# Altium schematic sheet [08] - OUTPUT.SchDoc
size A3; DocumentNumber: 8; SheetNumber: 8; SheetTotal: 10
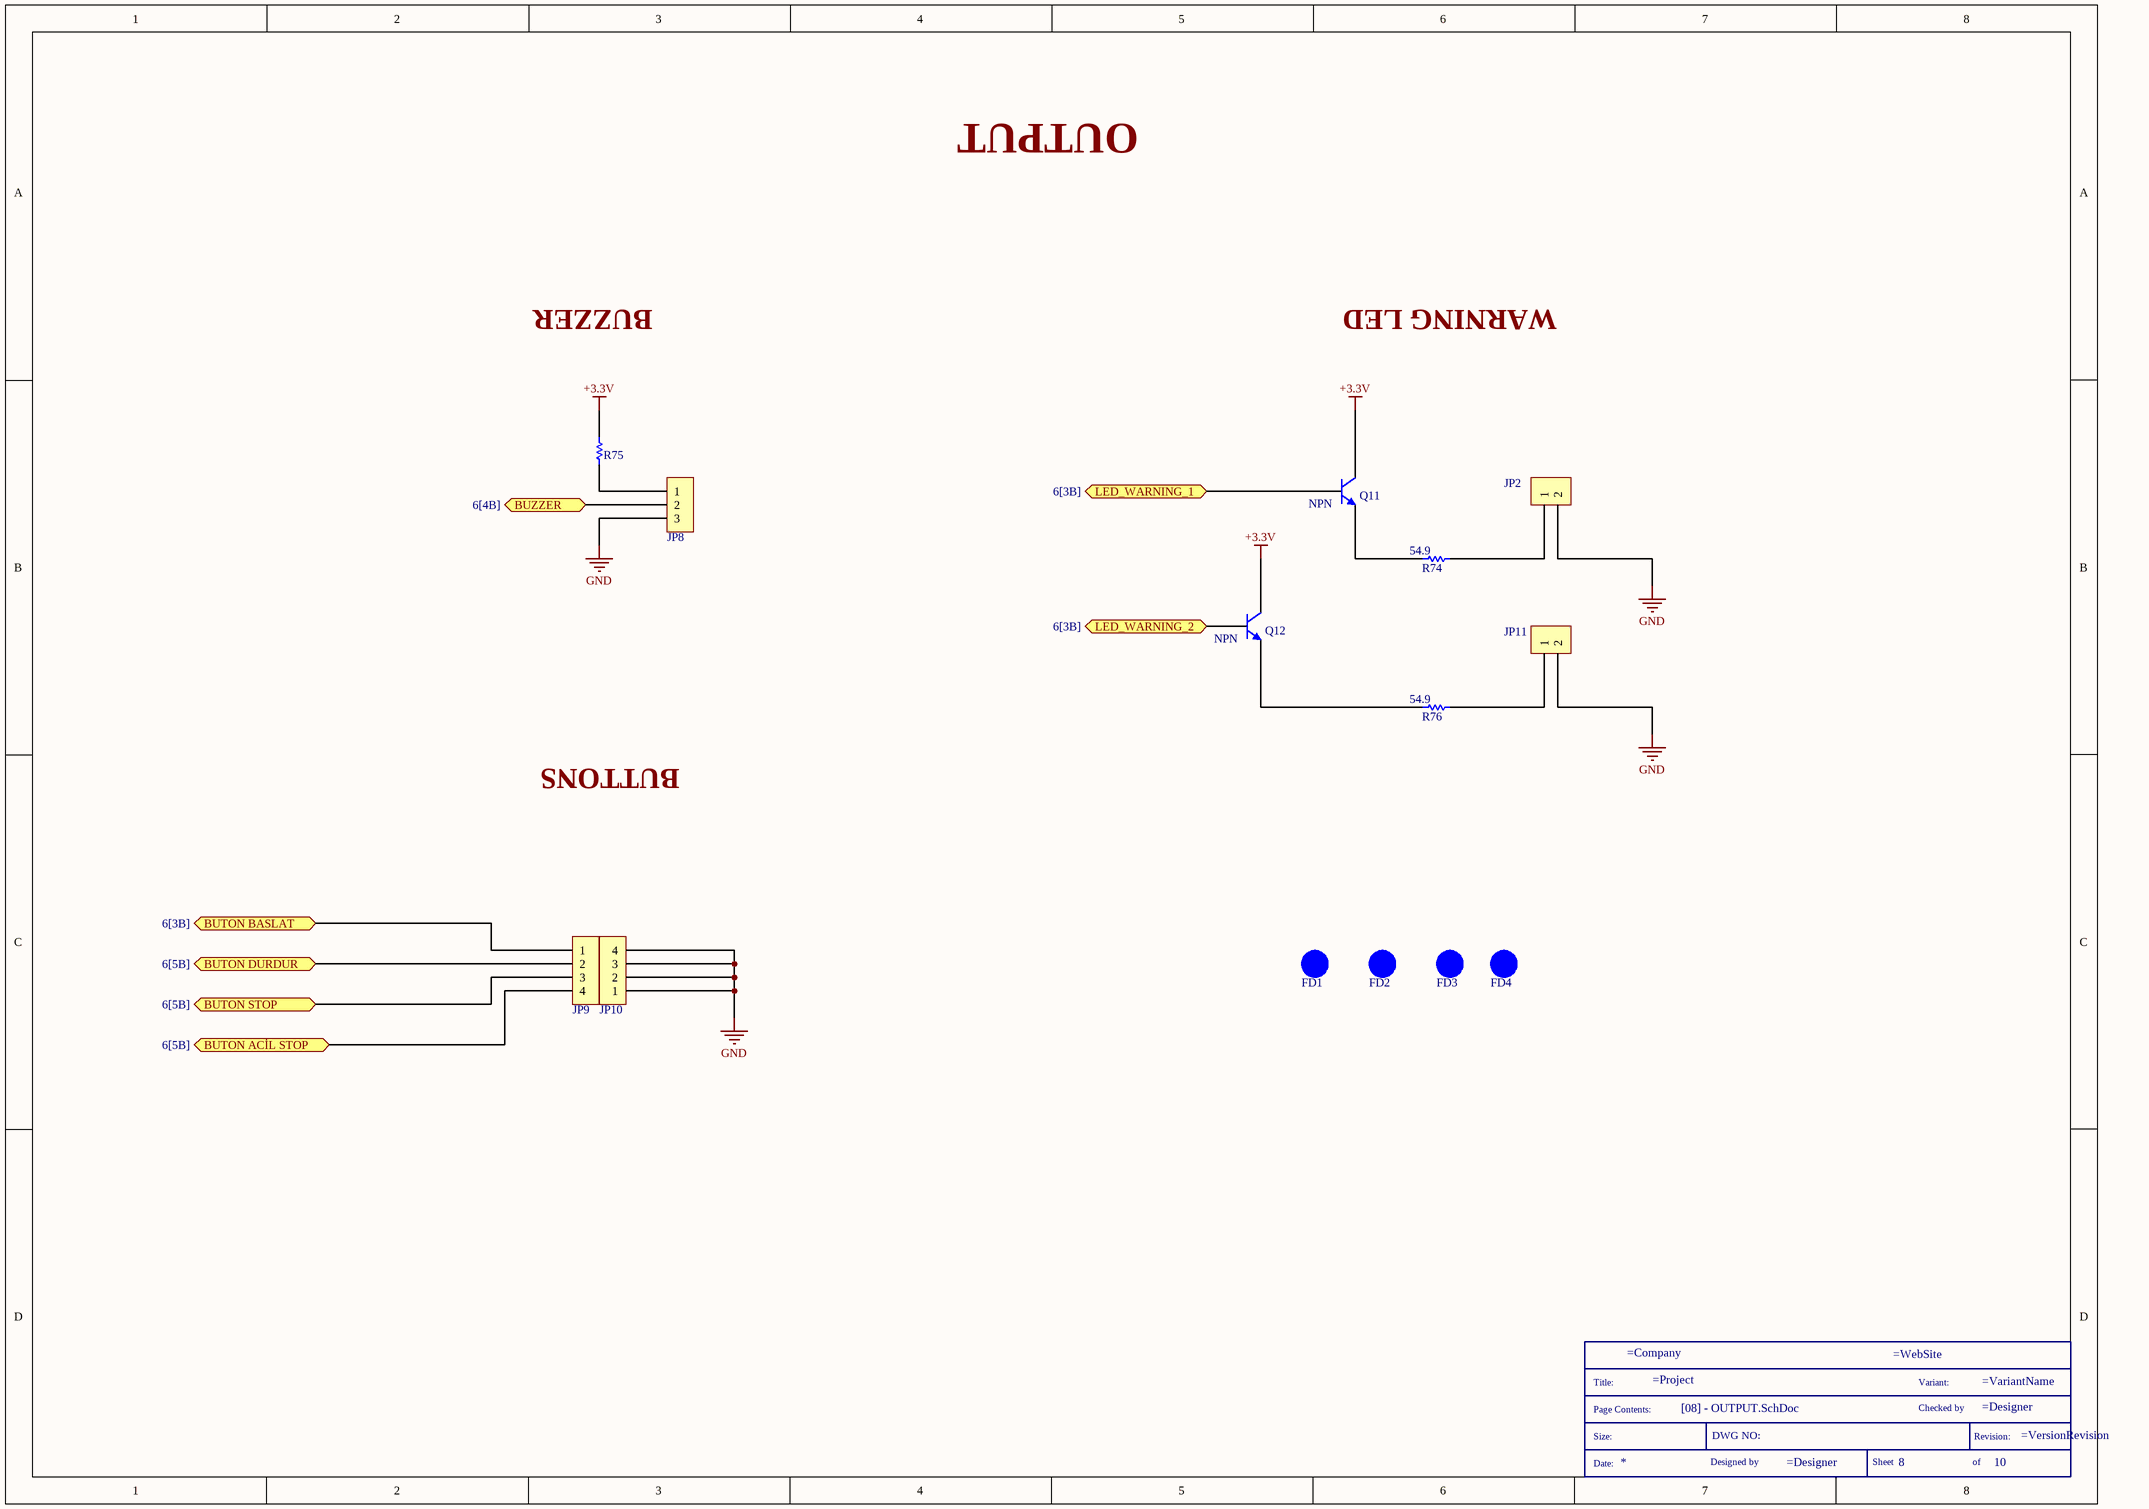
[diagram p0: [08] - OUTPUT.SchDoc]

## Parts
*  SCH_TITLE  (value not drawn)  (graphical)
FD1  FID_1MMC  [FID_40x120D]  (value not drawn)  (no BOM)
FD2  FID_1MMC  [FID_40x120D]  (value not drawn)  (no BOM)
FD3  FID_1MMC  [FID_40x120D]  (value not drawn)  (no BOM)
FD4  FID_1MMC  [FID_40x120D]  (value not drawn)  (no BOM)
JP2  HDR 1X2 2.54MM  [HDR_FEMALE_1X2_2.54MM]  (value not drawn)
JP8  HDR_1X3_2.54  [HDR_MALE_1X3_2.54MM]  (value not drawn)
JP9  HDR FEMALE 1X4 2.54MM  [HDR_FEMALE_1X4_2.54MM]  (value not drawn)
JP10  HDR FEMALE 1X4 2.54MM  [HDR_FEMALE_1X4_2.54MM]  (value not drawn)
JP11  HDR 1X2 2.54MM  [HDR_FEMALE_1X2_2.54MM]  (value not drawn)
Q11  NPN  [SOT-23 (TO-236)]
Q12  NPN  [SOT-23 (TO-236)]
R74  54.9  [RES_0805]
R75  0 1/8W  [RES_0805]  (value not drawn)
R76  54.9  [RES_0805]

## Ports
BUTON ACİL STOP (see 6[5B]), BUTON BASLAT (see 6[3B]), BUTON DURDUR (see 6[5B]), BUTON STOP (see 6[5B]), BUZZER (see 6[4B]), LED_WARNING_1 (see 6[3B]), LED_WARNING_2 (see 6[3B])

## Nets
+3.3V: Q11.1(C) Q12.1(C) R75.2
GND: JP2.2 JP8.3 JP10.1 JP10.2 JP10.3 JP10.4 JP11.2
BUTON ACİL STOP: JP9.4 ; port BUTON ACİL STOP
BUTON BASLAT: JP9.1 ; port BUTON BASLAT
BUTON DURDUR: JP9.2 ; port BUTON DURDUR
BUTON STOP: JP9.3 ; port BUTON STOP
BUZZER: JP8.2 ; port BUZZER
LED_WARNING_1: Q11.2(B) ; port LED_WARNING_1
LED_WARNING_2: Q12.2(B) ; port LED_WARNING_2
NetJP2_1: JP2.1 R74.2
NetJP8_1: JP8.1 R75.1
NetJP11_1: JP11.1 R76.2
NetQ11_3: Q11.3(E) R74.1
NetQ12_3: Q12.3(E) R76.1

## Notes on the sheet
- OUTPUT
- BUZZER
- WARNING LED
- BUTTONS
- (in symbol SCH_TITLE) Title:; Variant:; Page Contents:; Checked by; Size:; DWG NO:; Revision:; Date:; Designed by; Sheet; of

## Library data of the parts
* = SCH_TITLE: Schematic information
FD1-FD4 = FID_1MMC: Fiducial 40 mil diameter , 120 mil mask
JP2 JP11 = PPTC021LFBN-RC: HDR FEMALE 1X2 2.54MM; Manufacturer 1: Sullins Connector Solutions; Category: Rectangular Connectors - Headers, Receptacles, Female Sockets; Manufacturer Part Number 1: PPTC021LFBN-RC; Case/Package: 2POS_2.54mmPitch; Quantity: 1; Supplier 1: Digikey; Supplier Part Number 1: S7000-ND; Supplier Order Qty 1: 1; Supplier Stock 1: 46723; Supplier Unit Price 1: 0,32; Supplier Currency 1: $
JP8 = 61300311121: HDR MALE 1X3 2.54MM; Manufacturer 1: Wurth Electronics Inc.; Category: Rectangular Connectors - Headers, Male Pins; Manufacturer Part Number 1: 61300311121; Case/Package: 3POS pitch 2.54mm; Quantity: 1; Supplier 1: Digikey; Supplier Part Number 1: 732-5316-ND; Supplier Order Qty 1: 1; Supplier Stock 1: 109116; Supplier Unit Price 1: 0,13; Supplier Currency 1: $
JP9 JP10 = PPTC041LFBN-RC: Manufacturer 1: Sullins Connector Solutions; Category: Rectangular Connectors - Headers, Receptacles, Female Sockets; Case/Package: 4POS_2.54mmPitch; Manufacturer Part Number 1: PPTC041LFBN-RC; Quantity: 1; Supplier 1: Digikey; Supplier Part Number 1: S7002-ND; Supplier Order Qty 1: 1; Supplier Stock 1: 30769; Supplier Unit Price 1: 0,45; Supplier Currency 1: $
Q11 Q12 = MMBT2222A-7-F: TRANS NPN 40V 0.6A SMD SOT23-3; Manufacturer 1: Diodes Incorporated; Category: Transistors - Bipolar (BJT) - Single; Manufacturer Part Number 1: MMBT2222A-7-F; Case/Package: SOT-23-3; Quantity: 1; Supplier 1: Digikey; Supplier Part Number 1: MMBT2222A-FDICT-ND; Supplier Order Qty 1: 1; Supplier Stock 1: 1957039; Supplier Unit Price 1: 0,14; Supplier Currency 1: $
R74 R76 = ERJ-6ENF54R9V: RES SMD 54.9 OHM; Manufacturer 1: Panasonic Electronic Components; Category: Chip Resistor - Surface Mount; Manufacturer Part Number 1: ERJ-6ENF54R9V; Case/Package: 0805 (2012 Metric); Quantity: 1; Supplier 1: Digikey; Supplier Part Number 1: P54.9CCT-ND; Supplier Order Qty 1: 1; Supplier Stock 1: 43715; Supplier Unit Price 1: 0,1; Supplier Currency 1: $
R75 = CRCW08050000Z0EA": RES SMD 0 OHM JUMPER 1/8W 0805; Manufacturer 1: Vishay Dale; Case/Package: 0805 (2012 Metric); Manufacturer Part Number 1: CRCW08050000Z0EA; Category: Chip Resistor - Surface Mount; Quantity: 1; Supplier 1: Digikey; Supplier Part Number 1: 541-0.0ACT-ND; Supplier Stock 1: 746599; Supplier Unit Price 1: 0.1; Supplier Currency 1: $